# Altium schematic sheet Low PCB.SchDoc
size 381 x 241 mm; SheetNumber: 1; SheetTotal: 1
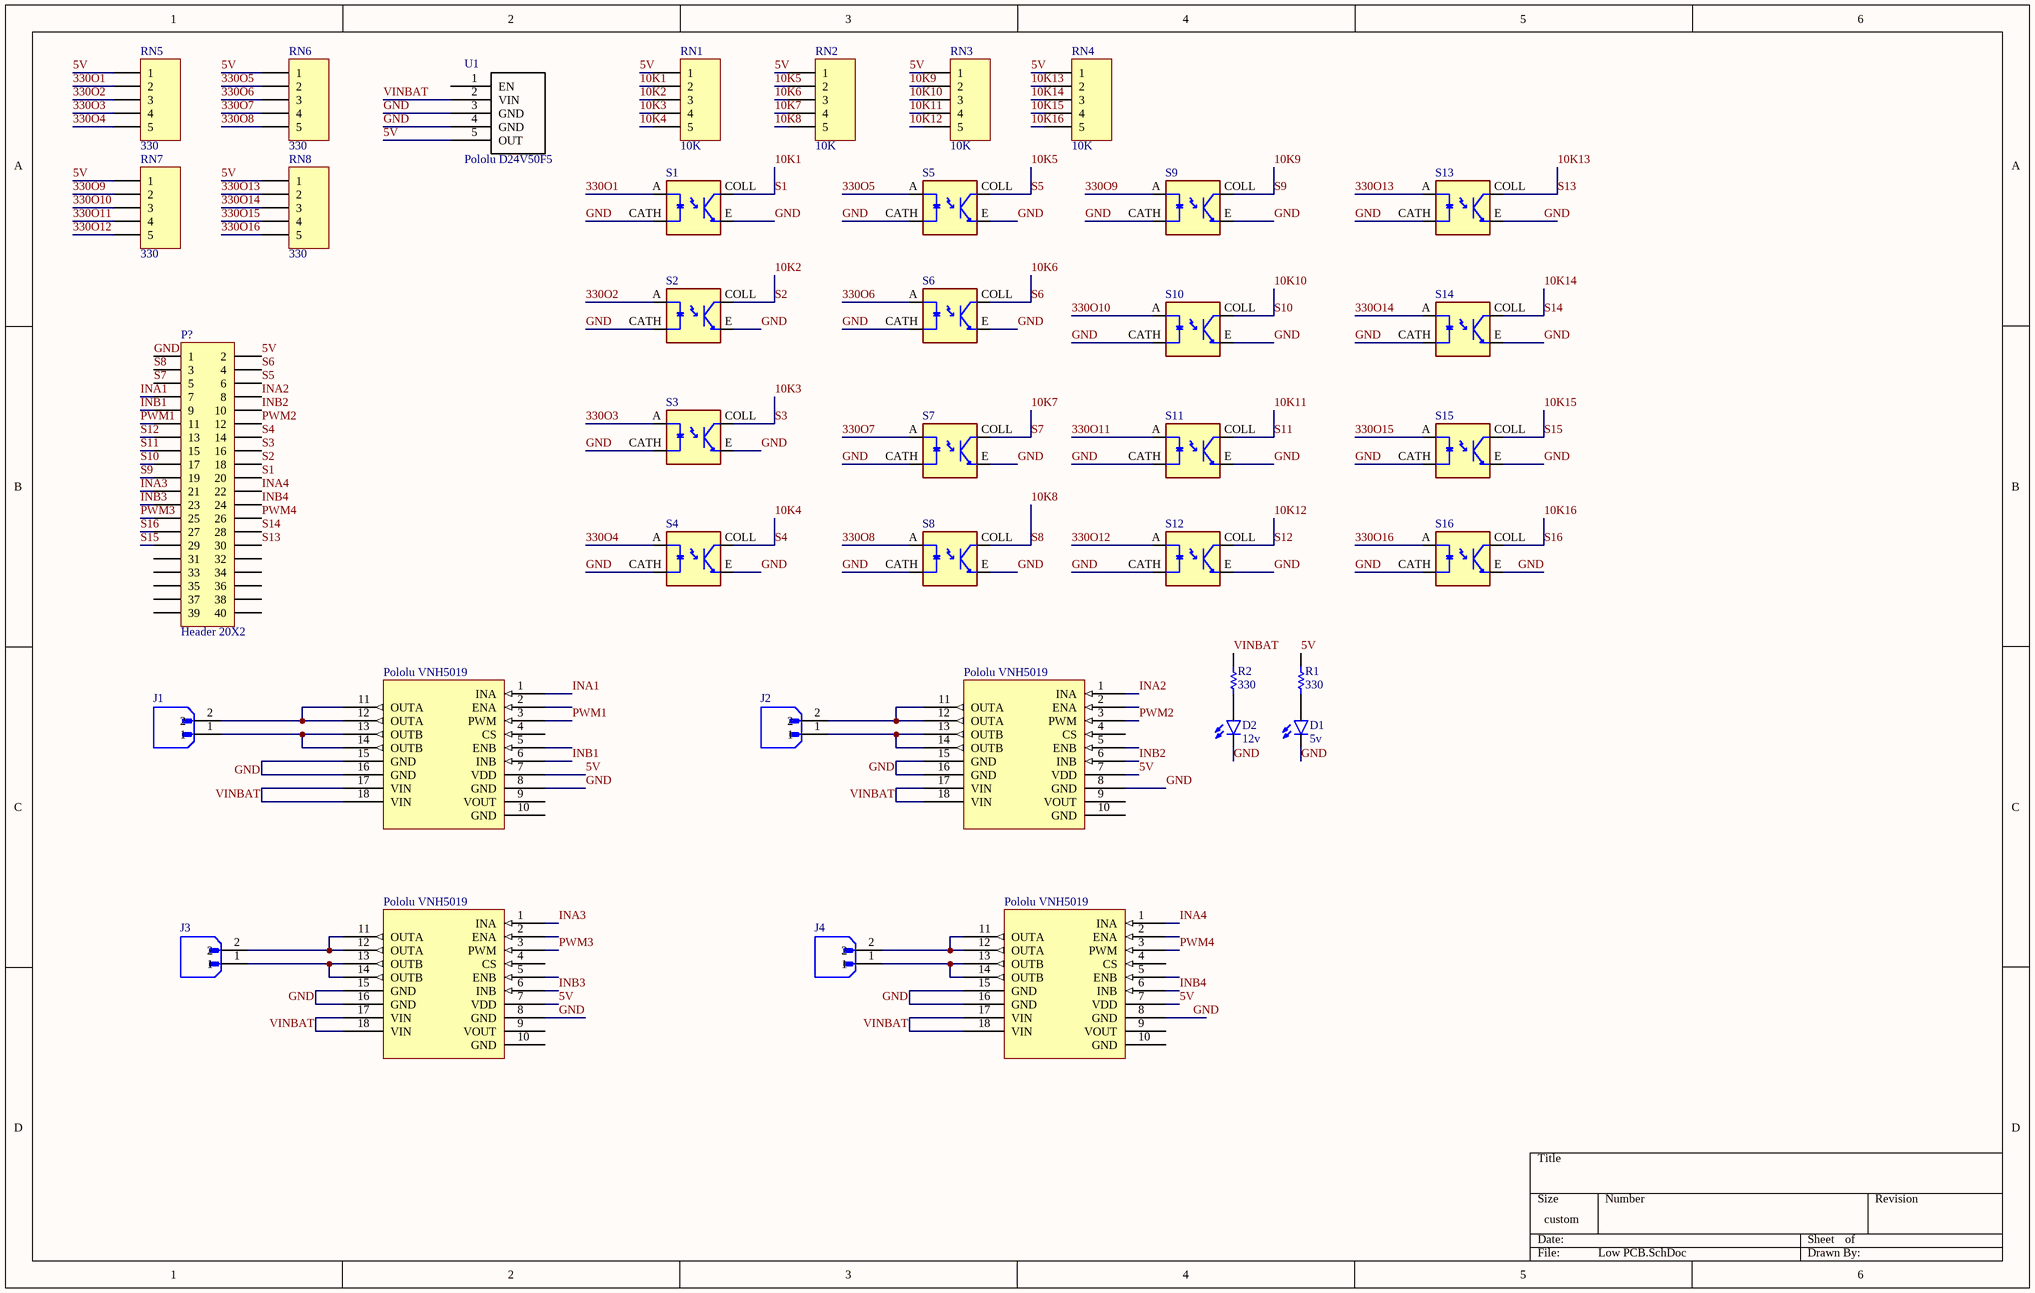
[diagram p0: Low PCB.SchDoc]

## Parts
D1  5v  [LED3MM]
D2  12v  [LED3MM]
driver_1  VNH5019  [PCBComponent_1]  (value not drawn)
driver_2  VNH5019  [PCBComponent_1]  (value not drawn)
driver_3  VNH5019  [PCBComponent_1]  (value not drawn)
driver_4  VNH5019  [PCBComponent_1]  (value not drawn)
J1  B2B-XH-A(LF)(SN)  [JST_B2B-XH-A(LF)(SN)]  (value not drawn)
J2  B2B-XH-A(LF)(SN)  [JST_B2B-XH-A(LF)(SN)]  (value not drawn)
J3  B2B-XH-A(LF)(SN)  [JST_B2B-XH-A(LF)(SN)]  (value not drawn)
J4  B2B-XH-A(LF)(SN)  [JST_B2B-XH-A(LF)(SN)]  (value not drawn)
P?  Header 20X2  [HDR2X20]
R1  330  [AXIAL-0.3]
R2  330  [AXIAL-0.3]
RN1  10K  [HDR1X5]
RN2  10K  [HDR1X5]
RN3  10K  [HDR1X5]
RN4  10K  [HDR1X5]
RN5  330  [HDR1X5]
RN6  330  [HDR1X5]
RN7  330  [HDR1X5]
RN8  330  [HDR1X5]
S1  TCRT5000  [OPTO_TCRT5000]  (value not drawn)
S2  TCRT5000  [OPTO_TCRT5000]  (value not drawn)
S3  TCRT5000  [OPTO_TCRT5000]  (value not drawn)
S4  TCRT5000  [OPTO_TCRT5000]  (value not drawn)
S5  TCRT5000  [OPTO_TCRT5000]  (value not drawn)
S6  TCRT5000  [OPTO_TCRT5000]  (value not drawn)
S7  TCRT5000  [OPTO_TCRT5000]  (value not drawn)
S8  TCRT5000  [OPTO_TCRT5000]  (value not drawn)
S9  TCRT5000  [OPTO_TCRT5000]  (value not drawn)
S10  TCRT5000  [OPTO_TCRT5000]  (value not drawn)
S11  TCRT5000  [OPTO_TCRT5000]  (value not drawn)
S12  TCRT5000  [OPTO_TCRT5000]  (value not drawn)
S13  TCRT5000  [OPTO_TCRT5000]  (value not drawn)
S14  TCRT5000  [OPTO_TCRT5000]  (value not drawn)
S15  TCRT5000  [OPTO_TCRT5000]  (value not drawn)
S16  TCRT5000  [OPTO_TCRT5000]  (value not drawn)
U1  D24V50F5 5v DC-DC Regulator  [PCBComponent_1]  (value not drawn)

## Nets
5V: driver_1.7(VDD) driver_2.7(VDD) driver_3.7(VDD) driver_4.7(VDD) P?.2 R1.2 RN1.1 RN2.1 RN3.1 RN4.1 RN5.1 RN6.1 RN7.1 RN8.1 U1.5(OUT)
10K1: P?.20 RN1.2 S1.COLL  [also labelled S1]
10K2: P?.18 RN1.3 S2.COLL  [also labelled S2]
10K3: P?.16 RN1.4 S3.COLL  [also labelled S3]
10K4: P?.14 RN1.5 S4.COLL  [also labelled S4]
10K5: P?.6 RN2.2 S5.COLL  [also labelled S5]
10K6: P?.4 RN2.3 S6.COLL  [also labelled S6]
10K7: P?.5 RN2.4 S7.COLL  [also labelled S7]
10K8: P?.3 RN2.5 S8.COLL  [also labelled S8]
10K9: P?.19 RN3.2 S9.COLL  [also labelled S9]
10K10: P?.17 RN3.3 S10.COLL  [also labelled S10]
10K11: P?.15 RN3.4 S11.COLL  [also labelled S11]
10K12: P?.13 RN3.5 S12.COLL  [also labelled S12]
10K13: P?.30 RN4.2 S13.COLL  [also labelled S13]
10K14: P?.28 RN4.3 S14.COLL  [also labelled S14]
10K15: P?.29 RN4.4 S15.COLL  [also labelled S15]
10K16: P?.27 RN4.5 S16.COLL  [also labelled S16]
330O1: RN5.2 S1.A
330O2: RN5.3 S2.A
330O3: RN5.4 S3.A
330O4: RN5.5 S4.A
330O5: RN6.2 S5.A
330O6: RN6.3 S6.A
330O7: RN6.4 S7.A
330O8: RN6.5 S8.A
330O9: RN7.2 S9.A
330O10: RN7.3 S10.A
330O11: RN7.4 S11.A
330O12: RN7.5 S12.A
330O13: RN8.2 S13.A
330O14: RN8.3 S14.A
330O15: RN8.4 S15.A
330O16: RN8.5 S16.A
GND: D1.K(C) D2.K(C) driver_1.8(GND) driver_1.15(GND) driver_1.16(GND) driver_2.8(GND) driver_2.15(GND) driver_2.16(GND) driver_3.8(GND) driver_3.15(GND) driver_3.16(GND) driver_4.8(GND) driver_4.15(GND) driver_4.16(GND) P?.1 S1.CATH S1.E S2.CATH S2.E S3.CATH S3.E S4.CATH S4.E S5.CATH S5.E S6.CATH S6.E S7.CATH S7.E S8.CATH S8.E S9.CATH S9.E S10.CATH S10.E S11.CATH S11.E S12.CATH S12.E S13.CATH S13.E S14.CATH S14.E S15.CATH S15.E S16.CATH S16.E U1.3(GND) U1.4(GND)
INA1: driver_1.1(INA) P?.7
INA2: driver_2.1(INA) P?.8
INA3: driver_3.1(INA) P?.21
INA4: driver_4.1(INA) P?.22
INB1: driver_1.6(INB) P?.9
INB2: driver_2.6(INB) P?.10
INB3: driver_3.6(INB) P?.23
INB4: driver_4.6(INB) P?.24
PWM1: driver_1.3(PWM) P?.11
PWM2: driver_2.3(PWM) P?.12
PWM3: driver_3.3(PWM) P?.25
PWM4: driver_4.3(PWM) P?.26
VINBAT: driver_1.17(VIN) driver_1.18(VIN) driver_2.17(VIN) driver_2.18(VIN) driver_3.17(VIN) driver_3.18(VIN) driver_4.17(VIN) driver_4.18(VIN) R2.2 U1.2(VIN)
NetD1_A: D1.A R1.1
NetD2_A: D2.A R2.1
Netdriver_1_11: driver_1.11(OUTA) driver_1.12(OUTA) J1.2
Netdriver_1_13: driver_1.13(OUTB) driver_1.14(OUTB) J1.1
Netdriver_2_11: driver_2.11(OUTA) driver_2.12(OUTA) J2.2
Netdriver_2_13: driver_2.13(OUTB) driver_2.14(OUTB) J2.1
Netdriver_3_11: driver_3.11(OUTA) driver_3.12(OUTA) J3.2
Netdriver_3_13: driver_3.13(OUTB) driver_3.14(OUTB) J3.1
Netdriver_4_11: driver_4.11(OUTA) driver_4.12(OUTA) J4.2
Netdriver_4_13: driver_4.13(OUTB) driver_4.14(OUTB) J4.1

Not connected (* = marked no-connect by the designer): driver_1 2(ENA) 4(CS) 5(ENB) 9(VOUT) 10(GND); driver_2 2(ENA) 4(CS) 5(ENB) 9(VOUT) 10(GND); driver_3 2(ENA) 4(CS) 5(ENB) 9(VOUT) 10(GND); driver_4 2(ENA) 4(CS) 5(ENB) 9(VOUT) 10(GND); P? 31 32 33 34 35 36 37 38 39 40; U1 1(EN)

## Notes on the sheet
- (in symbol PLU-D24V50F5) Pololu D24V50F5
- (in symbol VNH5019) Pololu VNH5019

## Library data of the parts
D1 D2 = TLLG4400: Green 569nm LED Indication - Discrete 1.9V Radial; MF: Vishay Semiconductors; MP: TLLG4400; SnapEDA_Link: https://www.snapeda.com/parts/TLLG4400/Vishay/view-part/?ref=snap; Availability: In Stock; Package: None; Check_prices: https://www.snapeda.com/parts/TLLG4400/Vishay/view-part/?ref=eda; Value: *; Purchase-URL: https://pricing.snapeda.com/search/part/TLLG4400/?ref=eda; Price: None
J1-J4 = B2B-XH-A(LF)(SN): Connector Header Through Hole 2 position 0.098 (2.50mm); MF: JST Sales; SnapEDA_Link: https://www.snapeda.com/parts/B2B-XH-A(LF)(SN)/JST+Sales+America+Inc./view-part/?ref=snap; Package: None; Value: *; MP: B2B-XH-A(LF)(SN); Check_prices: https://www.snapeda.com/parts/B2B-XH-A(LF)(SN)/JST+Sales+America+Inc./view-part/?ref=eda
P? = Header 20X2: Header, 20-Pin, Dual row; LatestRevisionDate: 17-Jul-2002; LatestRevisionNote: Re-released for DXP Platform.; Publisher: Altium Limited
R1 R2 = Res1: Resistor; Value: 1K; Published: 8-Jun-2000; LatestRevisionDate: 17-Jul-2002; LatestRevisionNote: Re-released for DXP Platform.; PackageReference: AXIAL-0.3; Publisher: Altium Limited; PackageDescription: Axial Device, Thru-Hole; 2 Leads; 0.3 in Pin Spacing
RN1-RN8 = Header 5: Header, 5-Pin; LatestRevisionDate: 17-Jul-2002; LatestRevisionNote: Re-released for DXP Platform.; Publisher: Altium Limited
S1-S16 = TCRT5000: 950 nm 60 mA Through Hole Reflective Optical Sensor with Transistor Output; Availability: Unavailable; MP: TCRT5000; Value: *; Price: None; Package: None
U1 = PLU-D24V50F5